# Altium project HFA08_8A600V_TO220.PrjPcb
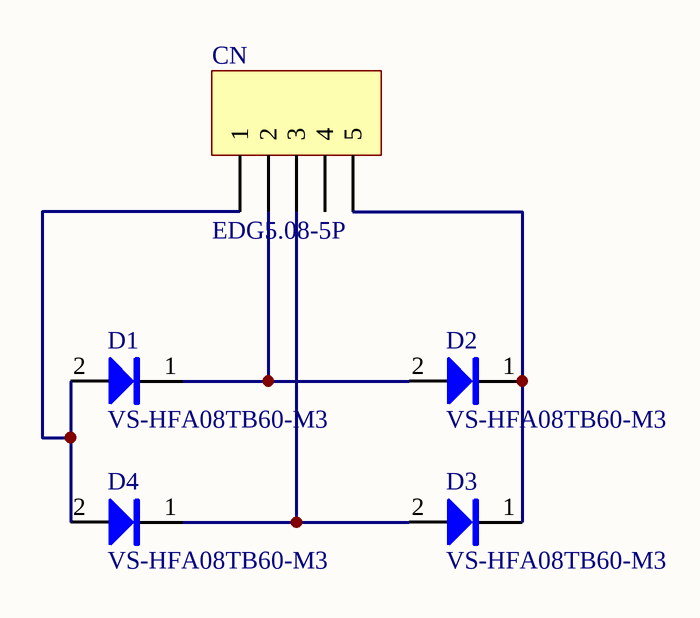
[diagram p0: Sheet1.SchDoc]
1 sheet, 5 parts. Net scope: global (net labels, ports and power ports of the same name join across sheets).
Board file: PCB1.PcbDoc

## Sheet Sheet1.SchDoc
size A4

### Parts
CN  EDG5.08-5P  [HX5.08-5L]
D1  VS-HFA08TB60-M3  [TO220AC]
D2  VS-HFA08TB60-M3  [TO220AC]
D3  VS-HFA08TB60-M3  [TO220AC]
D4  VS-HFA08TB60-M3  [TO220AC]

### Nets
NetCN_1: CN.1 D1.2(Anode) D4.2(Anode)
NetCN_2: CN.2 D1.1(Cathode) D2.2(Anode)
NetCN_3: CN.3 D3.2(Anode) D4.1(Cathode)
NetCN_5: CN.5 D2.1(Cathode) D3.1(Cathode)

Not connected (* = marked no-connect by the designer): CN 4

### Library data of the parts
D1-D4 = VS-HFA08TB60-M3: Ultrafast Soft Recovery Diado 8A 600V